# Altium schematic sheet HV_DAC_8ch_FPGA_LVDS.SchDoc: Fastino
size 420 x 297 mm; EDA_Number: ARTIQ; Projet: Fastino; Author: G.Kasprowicz; CompanyName: WUT ISE; DrawnBy: G.Kasprowicz; Organization: WUT ISE; Address1: PW ISE; Address2: Nowowiejska 15/19 00-665 Warsaw; Address3: gkasprow@gmail.com; DocumentNumber: 4; Revision: 2; SheetNumber: 5; SheetTotal: 12; ModifiedBy: -; CheckedDate: -; Title2: FPGA EEM connections; DivGrp: WUT ISE; Designer: G.Kasprowicz; SPICEModelCacheRFUWQEQD: <root> / <DocumentId>RFUWQEQD</DocumentId> / <CacheFrame Number="0"> / <Model Name="pk14" Kind="CKT"> / <Text>*.INC dhvqfn.s / .SUBCKT pk14 / +    1   2   3   4   5   6   7   8   9  10 / +   11  12  13  14 / +   15  16  17  18  19  20  21  22  23  24 / +   25  26  27  28 / * Pin Resistance / r1 1 1001 9.078E-02 / r2 2 1002 8.829E-02 / r3 3 1003 8.731E-02 / r4 4 1004 8.710E-02 / r5 5 1005 8.731E-02 / r6 6 1006 8.829E-02 / r7 7 1007 9.075E-02 / r8 8 1008 9.072E-02 / r9 9 1009 8.809E-02 / r10 10 1010 8.716E-02 / r11 11 1011 8.706E-02 / r12 12 1012 8.720E-02 / r13 13 1013 8.816E-02 / r14 14 1014 9.068E-02 / * Pin Inductance / l1 1001 15 2.981E-09 / l2 1002 16 2.447E-09 / l3 1003 17 2.304E-09 / l4 1004 18 2.291E-09 / l5 1005 19 2.307E-09 / l6 1006 20 2.449E-09 / l7 1007 21 2.971E-09 / l8 1008 22 2.972E-09 / l9 1009 23 2.425E-09 / l10 1010 24 2.286E-09 / l11 1011 25 2.280E-09 / l12 1012 26 2.286E-09 / l13 1013 27 2.425E-09 / l14 1014 28 2.975E-09 / .ENDS pk14</Text> / </Model> / </CacheFrame> / </root>; ModifiedDate: -; ProjectName: Sensor Box
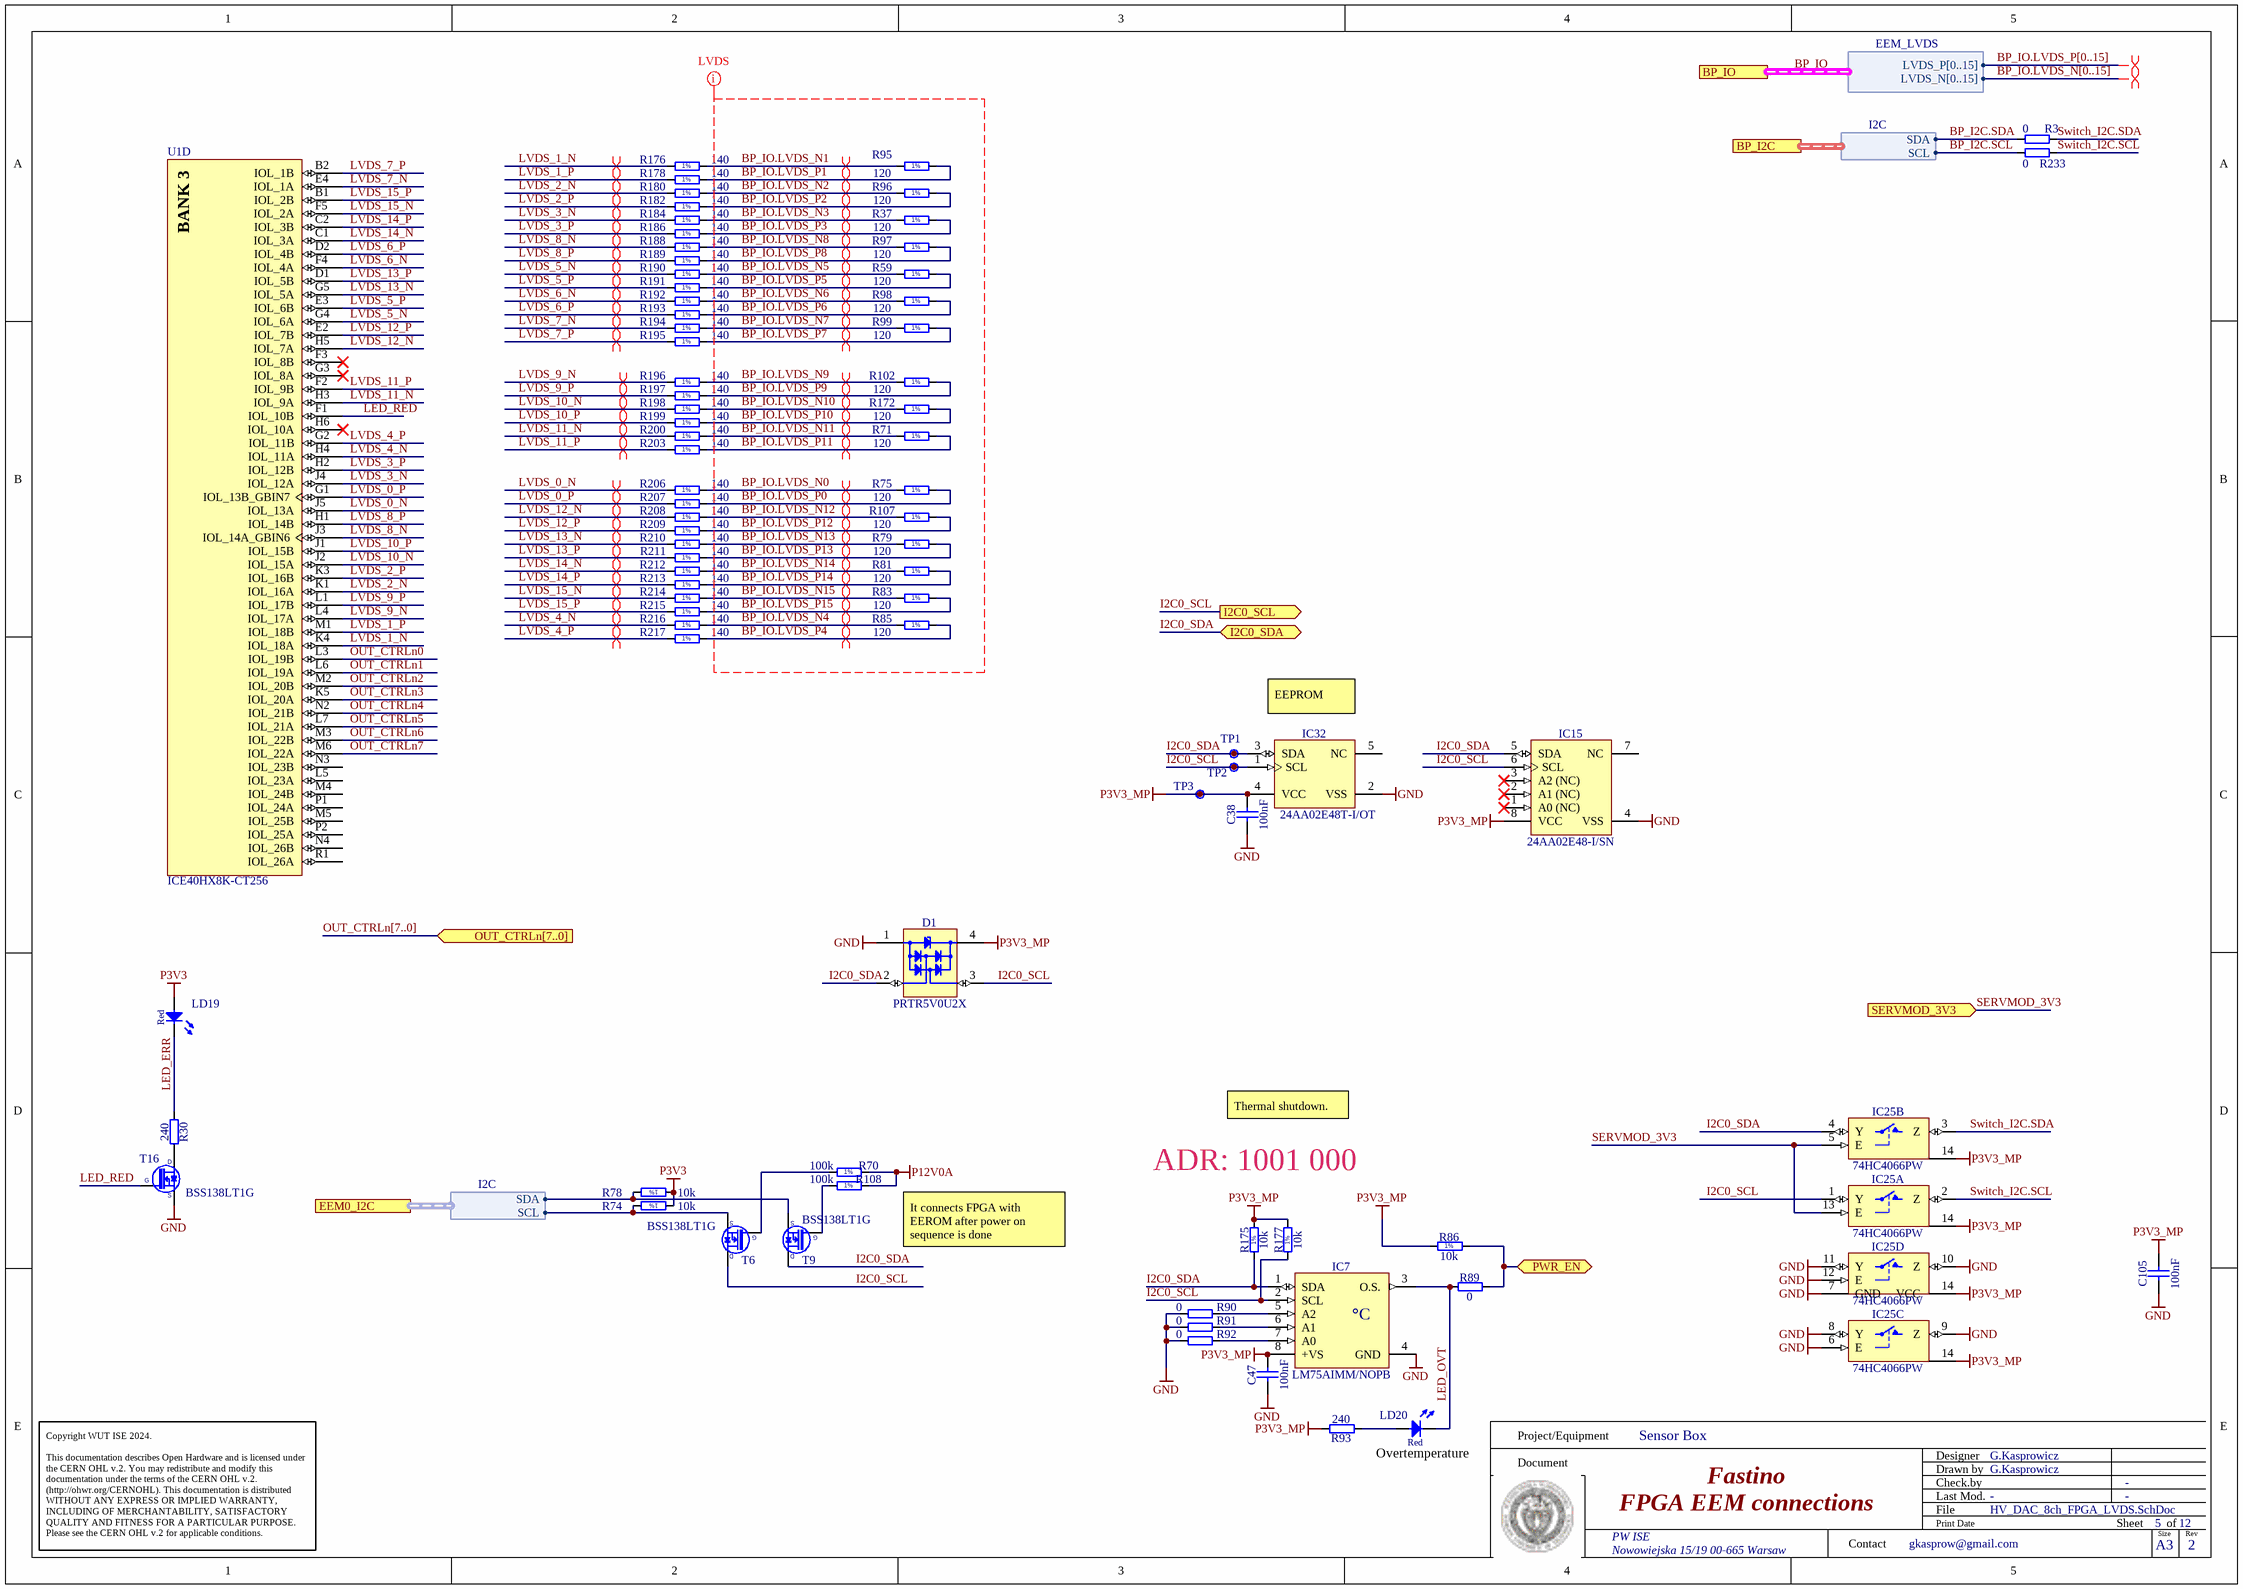
[diagram p0: HV_DAC_8ch_FPGA_LVDS.SchDoc]

## Parts
C38  100nF  [CAPC1005X55N]
C47  100nF  [CAPC1005X55N]
C105  100nF  [CAPC1005X55N]
D1  PRTR5V0U2X  [SOT190P230X110-4N]
IC7  LM75AIMM/NOPB  [SOP65P490X109-8N]
IC15  24AA02E48-I/SN  [SOIC127P600X175-8N]
IC25  74HC4066PW  [SOP65P640X110-14N]  (parts A,B,C,D of 4)
IC32  24AA02E48T-I/OT  [SOT95P280X145-5N]
LD19  Red  [LED_AVAGO_HSMC-C120]
LD20  Red  [LED_AVAGO_HSMC-C120]
R3  0  [RESC1005X40N]
R30  240  [RESC1005X40N]
R37  120  [RESC1005X40N]
R59  120  [RESC1005X40N]
R70  100k  [RESC1005X40N]
R71  120  [RESC1005X40N]
R74  10k  [RESC1005X40N]
R75  120  [RESC1005X40N]
R78  10k  [RESC1005X40N]
R79  120  [RESC1005X40N]
R81  120  [RESC1005X40N]
R83  120  [RESC1005X40N]
R85  120  [RESC1005X40N]
R86  10k  [RESC1005X40N]
R89  0  [RESC1005X40N]
R90  0  [RESC1005X40N]
R91  0  [RESC1005X40N]
R92  0  [RESC1005X40N]
R93  240  [RESC1005X40N]
R95  120  [RESC1005X40N]
R96  120  [RESC1005X40N]
R97  120  [RESC1005X40N]
R98  120  [RESC1005X40N]
R99  120  [RESC1005X40N]
R102  120  [RESC1005X40N]
R107  120  [RESC1005X40N]
R108  100k  [RESC1005X40N]
R172  120  [RESC1005X40N]
R175  10k  [RESC1005X40N]
R176  140  [RESC0603X28N]
R177  10k  [RESC1005X40N]
R178  140  [RESC0603X28N]
R180  140  [RESC0603X28N]
R182  140  [RESC0603X28N]
R184  140  [RESC0603X28N]
R186  140  [RESC0603X28N]
R188  140  [RESC0603X28N]
R189  140  [RESC0603X28N]
R190  140  [RESC0603X28N]
R191  140  [RESC0603X28N]
R192  140  [RESC0603X28N]
R193  140  [RESC0603X28N]
R194  140  [RESC0603X28N]
R195  140  [RESC0603X28N]
R196  140  [RESC0603X28N]
R197  140  [RESC0603X28N]
R198  140  [RESC0603X28N]
R199  140  [RESC0603X28N]
R200  140  [RESC0603X28N]
R203  140  [RESC0603X28N]
R206  140  [RESC0603X28N]
R207  140  [RESC0603X28N]
R208  140  [RESC0603X28N]
R209  140  [RESC0603X28N]
R210  140  [RESC0603X28N]
R211  140  [RESC0603X28N]
R212  140  [RESC0603X28N]
R213  140  [RESC0603X28N]
R214  140  [RESC0603X28N]
R215  140  [RESC0603X28N]
R216  140  [RESC0603X28N]
R217  140  [RESC0603X28N]
R233  0  [RESC1005X40N]
T6  BSS138LT1G  [SOT95P240X110-3N]
T9  BSS138LT1G  [SOT95P240X110-3N]
T16  BSS138LT1G  [SOT95P240X110-3N]
TP1  Test Point  [TPS127]  (value not drawn)
TP2  Test Point  [TPS127]  (value not drawn)
TP3  Test Point  [TPS127]  (value not drawn)
U1  ICE40HX8K-CT256  [LATC-caBGA-256]  (part D of 5)

## Ports
BP_I2C (harness I2C), BP_IO (harness EEM_LVDS), EEM0_I2C (harness I2C), I2C0_SCL (out), I2C0_SDA (bidir), OUT_CTRLn[7..0] (in), PWR_EN (bidir), SERVMOD_3V3 (in)

## Harnesses
I2C: SDA, SCL
EEM_LVDS: LVDS_P[0..15], LVDS_N[0..15]

## Nets
GND: C38.1 C47.1 C105.1 D1.1(GND) IC7.4(GND) IC15.4(VSS) IC25.6(E) IC25.7(GND) IC25.8(Y) IC25.9(Z) IC25.10(Z) IC25.11(Y) IC25.12(E) IC32.2(VSS) R90.1 R91.1 R92.1 T16.2(S)
P3V3: LD19.2(A) R74.1 R78.1
P3V3_MP: C38.2 C47.2 C105.2 D1.4(VCC) IC7.8(+VS) IC15.8(VCC) IC25.14(VCC) IC32.4(VCC) R86.1 R93.2 R175.2 R177.2 TP3.1
P12V0A: R70.2 R108.2
BP_I2C.SCL: R233.1 ; port BP_I2C.SCL
BP_I2C.SDA: R3.1 ; port BP_I2C.SDA
BP_IO.LVDS_N0: R75.1 R206.2
BP_IO.LVDS_N1: R95.1 R176.2
BP_IO.LVDS_N2: R96.1 R180.2
BP_IO.LVDS_N3: R37.1 R184.2
BP_IO.LVDS_N4: R85.1 R216.2
BP_IO.LVDS_N5: R59.1 R190.2
BP_IO.LVDS_N6: R98.1 R192.2
BP_IO.LVDS_N7: R99.1 R194.2
BP_IO.LVDS_N8: R97.1 R188.2
BP_IO.LVDS_N9: R102.1 R196.2
BP_IO.LVDS_N10: R172.1 R198.2
BP_IO.LVDS_N11: R71.1 R200.2
BP_IO.LVDS_N12: R107.1 R208.2
BP_IO.LVDS_N13: R79.1 R210.2
BP_IO.LVDS_N14: R81.1 R212.2
BP_IO.LVDS_N15: R83.1 R214.2
BP_IO.LVDS_P0: R75.2 R207.2
BP_IO.LVDS_P1: R95.2 R178.2
BP_IO.LVDS_P2: R96.2 R182.2
BP_IO.LVDS_P3: R37.2 R186.2
BP_IO.LVDS_P4: R85.2 R217.2
BP_IO.LVDS_P5: R59.2 R191.2
BP_IO.LVDS_P6: R98.2 R193.2
BP_IO.LVDS_P7: R99.2 R195.2
BP_IO.LVDS_P8: R97.2 R189.2
BP_IO.LVDS_P9: R102.2 R197.2
BP_IO.LVDS_P10: R172.2 R199.2
BP_IO.LVDS_P11: R71.2 R203.2
BP_IO.LVDS_P12: R107.2 R209.2
BP_IO.LVDS_P13: R79.2 R211.2
BP_IO.LVDS_P14: R81.2 R213.2
BP_IO.LVDS_P15: R83.2 R215.2
I2C0_SCL: D1.3(I/O2) IC7.2(SCL) IC15.6(SCL) IC25.1(Y) IC32.1(SCL) R177.1 T6.3(D) TP2.1 ; port I2C0_SCL
I2C0_SDA: D1.2(I/O1) IC7.1(SDA) IC15.5(SDA) IC25.4(Y) IC32.3(SDA) R175.1 T9.3(D) TP1.1 ; port I2C0_SDA
LED_ERR: LD19.1(C) R30.1
LED_OVT: IC7.3(O.S.) LD20.1(C) R89.1
LED_RED: T16.1(G) U1.F1(IOL_10B)
LVDS_0_N: R206.1 U1.J5(IOL_13A)
LVDS_0_P: R207.1 U1.G1(IOL_13B_GBIN7)
LVDS_1_N: R176.1 U1.K4(IOL_18A)
LVDS_1_P: R178.1 U1.M1(IOL_18B)
LVDS_2_N: R180.1 U1.K1(IOL_16A)
LVDS_2_P: R182.1 U1.K3(IOL_16B)
LVDS_3_N: R184.1 U1.J4(IOL_12A)
LVDS_3_P: R186.1 U1.H2(IOL_12B)
LVDS_4_N: R216.1 U1.H4(IOL_11A)
LVDS_4_P: R217.1 U1.G2(IOL_11B)
LVDS_5_N: R190.1 U1.G4(IOL_6A)
LVDS_5_P: R191.1 U1.E3(IOL_6B)
LVDS_6_N: R192.1 U1.F4(IOL_4A)
LVDS_6_P: R193.1 U1.D2(IOL_4B)
LVDS_7_N: R194.1 U1.E4(IOL_1A)
LVDS_7_P: R195.1 U1.B2(IOL_1B)
LVDS_8_N: R188.1 U1.J3(IOL_14A_GBIN6)
LVDS_8_P: R189.1 U1.H1(IOL_14B)
LVDS_9_N: R196.1 U1.L4(IOL_17A)
LVDS_9_P: R197.1 U1.L1(IOL_17B)
LVDS_10_N: R198.1 U1.J2(IOL_15A)
LVDS_10_P: R199.1 U1.J1(IOL_15B)
LVDS_11_N: R200.1 U1.H3(IOL_9A)
LVDS_11_P: R203.1 U1.F2(IOL_9B)
LVDS_12_N: R208.1 U1.H5(IOL_7A)
LVDS_12_P: R209.1 U1.E2(IOL_7B)
LVDS_13_N: R210.1 U1.G5(IOL_5A)
LVDS_13_P: R211.1 U1.D1(IOL_5B)
LVDS_14_N: R212.1 U1.C1(IOL_3A)
LVDS_14_P: R213.1 U1.C2(IOL_3B)
LVDS_15_N: R214.1 U1.F5(IOL_2A)
LVDS_15_P: R215.1 U1.B1(IOL_2B)
OUT_CTRLn0: U1.L3(IOL_19B)
OUT_CTRLn1: U1.L6(IOL_19A)
OUT_CTRLn2: U1.M2(IOL_20B)
OUT_CTRLn3: U1.K5(IOL_20A)
OUT_CTRLn4: U1.N2(IOL_21B)
OUT_CTRLn5: U1.L7(IOL_21A)
OUT_CTRLn6: U1.M3(IOL_22B)
OUT_CTRLn7: U1.M6(IOL_22A)
PWR_EN: R86.2 R89.2 ; port PWR_EN
SERVMOD_3V3: IC25.5(E) IC25.13(E) ; port SERVMOD_3V3
Switch_I2C.SCL: IC25.2(Z) R233.2
Switch_I2C.SDA: IC25.3(Z) R3.2
NetIC7_5: IC7.5(A2) R90.2
NetIC7_6: IC7.6(A1) R91.2
NetIC7_7: IC7.7(A0) R92.2
NetLD20_2: LD20.2(A) R93.1
NetR30_2: R30.2 T16.3(D)
NetR70_1: R70.1 T6.1(G)
NetR74_2: R74.2 T6.2(S) ; port EEM0_I2C.SCL
NetR78_2: R78.2 T9.2(S) ; port EEM0_I2C.SDA
NetR108_1: R108.1 T9.1(G)

Not connected (* = marked no-connect by the designer): IC15 1(A0_(NC))* 2(A1_(NC))* 3(A2_(NC))* 7(NC); IC32 5(NC); U1 F3(IOL_8B)* G3(IOL_8A)* H6(IOL_10A)* L5(IOL_23A) M4(IOL_24B) M5(IOL_25B) N3(IOL_23B) N4(IOL_26B) P1(IOL_24A) P2(IOL_25A) R1(IOL_26A)

## Buses and harness runs
bus BP_IO.LVDS_N[0..15]
bus BP_IO.LVDS_P[0..15]
bus OUT_CTRLn[7..0] = port OUT_CTRLn[7..0]
harness BP_IO = port BP_IO

## Layout directives
differential pair; net class D100: BP_IO.LVDS_N0, BP_IO.LVDS_N1, BP_IO.LVDS_N2, BP_IO.LVDS_N3, BP_IO.LVDS_N4, BP_IO.LVDS_N5, BP_IO.LVDS_N6, BP_IO.LVDS_N7, BP_IO.LVDS_N8, BP_IO.LVDS_N9, BP_IO.LVDS_N10, BP_IO.LVDS_N11, BP_IO.LVDS_N12, BP_IO.LVDS_N13, BP_IO.LVDS_N14, BP_IO.LVDS_N15, BP_IO.LVDS_P0, BP_IO.LVDS_P1, BP_IO.LVDS_P2, BP_IO.LVDS_P3, BP_IO.LVDS_P4, BP_IO.LVDS_P5, BP_IO.LVDS_P6, BP_IO.LVDS_P7, BP_IO.LVDS_P8, BP_IO.LVDS_P9, BP_IO.LVDS_P10, BP_IO.LVDS_P11, BP_IO.LVDS_P12, BP_IO.LVDS_P13, BP_IO.LVDS_P14, BP_IO.LVDS_P15, LVDS_0_N, LVDS_0_P, LVDS_1_N, LVDS_1_P, LVDS_2_N, LVDS_2_P, LVDS_3_N, LVDS_3_P, LVDS_4_N, LVDS_4_P, LVDS_5_N, LVDS_5_P, LVDS_6_N, LVDS_6_P, LVDS_7_N, LVDS_7_P, LVDS_8_N, LVDS_8_P, LVDS_9_N, LVDS_9_P, LVDS_10_N, LVDS_10_P, LVDS_11_N, LVDS_11_P, LVDS_12_N, LVDS_12_P, LVDS_13_N, LVDS_13_P, LVDS_14_N, LVDS_14_P, LVDS_15_N, LVDS_15_P
net class LVDS: BP_IO.LVDS_N0, BP_IO.LVDS_N1, BP_IO.LVDS_N2, BP_IO.LVDS_N3, BP_IO.LVDS_N4, BP_IO.LVDS_N5, BP_IO.LVDS_N6, BP_IO.LVDS_N7, BP_IO.LVDS_N8, BP_IO.LVDS_N9, BP_IO.LVDS_N10, BP_IO.LVDS_N11, BP_IO.LVDS_N12, BP_IO.LVDS_N13, BP_IO.LVDS_N14, BP_IO.LVDS_N15, BP_IO.LVDS_P0, BP_IO.LVDS_P1, BP_IO.LVDS_P2, BP_IO.LVDS_P3, BP_IO.LVDS_P4, BP_IO.LVDS_P5, BP_IO.LVDS_P6, BP_IO.LVDS_P7, BP_IO.LVDS_P8, BP_IO.LVDS_P9, BP_IO.LVDS_P10, BP_IO.LVDS_P11, BP_IO.LVDS_P12, BP_IO.LVDS_P13, BP_IO.LVDS_P14, BP_IO.LVDS_P15
differential pair; differential pair class Diff_100Ohm; net class D100: (no net found under the mark)

## Notes on the sheet
- EEPROM
- Thermal shutdown.
- ADR: 1001 000
- It connects FPGA with EEROM after power on sequence is done
- Overtemperature
- Project/Equipment
- Document
- Designer
- Drawn by
- Check.by
- Copyright WUT ISE 2024.
  This documentation describes Open Hardware and is licensed under the CERN OHL v.2. You may redistribute and modify this documentation under the terms of the CERN OHL v.2. (http://ohwr.org/CERNOHL). This documentation is distributed WITHOUT ANY EXPRESS OR IMPLIED WARRANTY, INCLUDING OF MERCHANTABILITY, SATISFACTORY QUALITY AND FITNESS FOR A PARTICULAR PURPOSE. Please see the CERN OHL v.2 for applicable conditions.
- Contact
- File
- Last Mod.
- Print Date
- Sheet
- Size
- A3
- of
- Rev
- (in symbol CMP-0962-00001-1, part D) BANK 3
- (in symbol LM75AIMM/NOPB) °C
- (in symbol R0201_140R_1%_0.05W_200PPM) 1%
- (in symbol R0402_10k_1%_0.0625W_100PPM) 1%
- (in symbol R0402_10K_1%_0.0625W_100PPM) 1%
- (in symbol R0402_100K_1%_0.0625W_100PPM) 1%
- (in symbol R0402_120R_1%_0.0625W_100PPM) 1%

## Library data of the parts
C38 C47 C105 = CC0402_100NF_16V_10%_X5R: Non-polarised capacitor; Part Description: SMD Multilayer Chip Ceramic Capacitor; Manufacturer: GENERIC; Manufacturer1 Part Number: GRM155R61C104KA88D; Voltage: 16V; TC: X5R; Tolerance: ±10%; Part Number: CC0402_100NF_16V_10%_X5R; Component Kind: Standard; Component Type: Standard; Pin Count: 2; Value: 100nF; Status: None; Manufacturer Part Number: CC0402_100NF_16V_10%_X5R; Case: 0402; Mounted: Yes; Socket: No; SMD: Yes; Sense: No; Manufacturer1 Example: MURATA; Manufacturer1 ComponentHeight: 0.55mm; HelpURL: \\cern.ch\dfs\Applications\Altium\Datasheets\CC0402_X5R_MURATA_GRM.pdf; Author: CERN DEM JLC; CreateDate: 10.12.2013; LatestRevisionDate: 10.12.2013
D1 = PRTR5V0U2X: Ultra Low Capacitance Double Rail-to-Rail ESD Protection Diode; Part Description: Ultra Low Capacitance (1pF) Double Rail-to-Rail ESD Protection Diode (8kV); Manufacturer: NXP SEMICONDUCTORS; Voltage: 5.5V; PressFit: No; Bonding: No; Part Number: PRTR5V0U2X; Component Kind: Standard; Component Type: Standard; Device: PRTR5V0U2X; PackageDescription: SOT143B, SOT, 1.90mm Pitch; 4 Pin, 1.30mm W X 2.90mm L X 1.10mm H body, IPC Medium Density; Manufacturer Part Number: PRTR5V0U2X; Pin Count: 4; Case: SOT143B; Mounted: Yes; Socket: No; SMD: Yes; Sense: No; ComponentHeight: 1.1mm; HelpURL: \\cern.ch\dfs\Applications\Altium\Datasheets\PRTR5V0U2X.pdf; Author: CERN DEM JLC; CreateDate: 22.03.2011; LatestRevisionDate: 22.03.2011
IC7 = LM75AIMM/NOPB: Digital Temperature Sensor and Thermal Watchdog with Two-Wire Interface; Part Description: -25° to +100°C ±2°C Digital Temperature Sensor and Thermal Watchdog with Two-Wire Interface; Manufacturer: TEXAS INSTRUMENTS; PressFit: No; Bonding: No; Part Number: LM75AIMM/NOPB; Component Kind: Standard; Component Type: Standard; Device: LM75AIMM/NOPB; PackageDescription: SOP, 0.65mm pitch; 8 pin,3.00mm W X 3.00mm L X 1.09mm H bodyI, PC Medium Density; Manufacturer Part Number: LM75AIMM/NOPB; Pin Count: 8; Case: SSOP8; Mounted: Yes; Socket: No; SMD: Yes; Sense: No; ComponentHeight: 1.09mm; HelpURL: \\cern.ch\dfs\Applications\Altium\Datasheets\LM75AIMM-NOPB.pdf; Author: CERN DEM JLC; CreateDate: 15.10.2012; LatestRevisionDate: 15.10.2012
IC15 = MEM_24AA02E48-I/SN: 1.7V-5.5V, 2K I2C™ Serial EEPROMs with EUI-48™ Node Identity; Manufacturer: MICROCHIP TECHNOLOGY; PressFit: No; Bonding: No; Part Number: 24AA02E48-I/SN; Component Kind: Standard; Component Type: Standard; Device: 24AA02E48-I/SN; PackageDescription: SOIC, 1.27mm Pitch; 8 Pin - Body 4x5mm, IPC Medium Density; Part Description: 1.7V-5.5V, 2K I2C™ Serial EEPROMs with EUI-48™ Node Identity; Manufacturer Part Number: 24AA02E48-I/SN; Pin Count: 8; Case: SOIC8; Mounted: Yes; Socket: No; SMD: Yes; Sense: No; ComponentHeight: 1.75mm; HelpURL: \\cern.ch\dfs\Applications\Altium\Datasheets\24AA025E48-I-SN.pdf; Author: CERN DEM MR; CreateDate: 19.07.2016; LatestRevisionDate: 19.07.2016
IC25 = 74HC4066PW: Part Description: Quad Single-Pole Single-Throw Analog Switch; Manufacturer: NXP SEMICONDUCTORS; PressFit: No; Bonding: No; Table: Standard Logic; Part Number: 74HC4066PW; Component Kind: Standard; Component Type: Standard; Device: 74HC4066PW; PackageDescription: SOP, 14-Leads, Body 4.4x5mm (max), Pitch 0.65mm, IPC Medium Density; Manufacturer Part Number: 74HC4066PW; Pin Count: 14; Case: TSSOP14; Mounted: Yes; Socket: No; SMD: Yes; ComponentHeight: 1.1mm; Author: CERN DEM JLC; HelpURL: \\cern.ch\dfs\Applications\Altium\Datasheets\74HC4066PW.pdf; CreateDate: 2014-11-19; LatestRevisionDate: 2014-11-19
IC32 = 24AA02E48T-I/OT: 1.7V-5.5V, 2K I2C Serial EEPROM With EUI-48 Node Identity; Manufacturer: MICROCHIP TECHNOLOGY; PressFit: No; Bonding: No; Part Number: 24AA02E48T-I/OT; Component Kind: Standard; Component Type: Standard; Device: 24AA02E48T-I/OT; PackageDescription: SOT, 0.95mm pitch; 5 pin, 1.60mm W X 2.90mm L X 1.45mm H body, IPC Medium Density; Part Description: 1.7V-5.5V, 2K I2C Serial EEPROM With EUI-48 Node Identity; Manufacturer Part Number: 24AA02E48T-I/OT; Pin Count: 5; Case: SOT23-5; Mounted: Yes; Socket: No; SMD: Yes; Sense: No; ComponentHeight: 1.45mm; HelpURL: \\cern.ch\dfs\Applications\Altium\Datasheets\24AA02E48T-I-OT.pdf; Author: CERN DEM MR; CreateDate: 31.03.2016; LatestRevisionDate: 31.03.2016
LD19 LD20 = LED_AVAGO_HSMC-C120: LED Red 1C 2A; Part Description: High Performance Right Angle Chip Red LED; Manufacturer: AVAGO TECHNOLOGIES; PressFit: No; Bonding: No; Part Number: LED_AVAGO_HSMC-C120; Component Kind: Standard; Component Type: Standard; Color: Red; PackageDescription: Red Chip LED, 2-Leads, Body 1.7x1.1mm, Side Emitting Package; Manufacturer Part Number: HSMC-C120; Pin Count: 2; Mounted: Yes; Socket: No; SMD: Yes; Sense: No; ComponentHeight: 0.7mm; HelpURL: \\cern.ch\dfs\Applications\Altium\Datasheets\LED_AVAGO_HSMC-C120.pdf; ComponentLink1URL: \\cern.ch\dfs\Applications\Altium\Datasheets\LED_AVAGO_HSMC-C120_DESIGN-GUIDE.pdf; ComponentLink1Description: Design Guide; Author: CERN DEM JMW; CreateDate: 22.07.2009; LatestRevisionDate: 20.06.2012
R3 R233 = R0402_0R_JUMPER: Resistor; Part Description: 1A (0.05R Max DC Resistance) Zero Ohm Jumper; Manufacturer: GENERIC; Manufacturer1 Part Number: 232270591001L; PressFit: No; Part Number: R0402_0R_JUMPER; Component Kind: Standard; Component Type: Standard; Pin Count: 2; Value: 0; Status: Not Recommended; Manufacturer Part Number: R0402_0R_JUMPER; Case: 0402; Mounted: Yes; Sense: No; Socket: No; SMD: Yes; Manufacturer1 Example: YAGEO PHYCOMP; Manufacturer1 ComponentHeight: 0.4mm; HelpURL: \\cern.ch\dfs\Applications\Altium\Datasheets\R0402_Phycomp_RC0402.pdf; Author: CERN DEM JLC; CreateDate: 03.12.2007; LatestRevisionDate: 17.10.2012
R30 R93 = R0402_240R_1%_0.0625W_100PPM: Resistor - 1%; Part Description: General Purpose Thick Film Chip Resistor; Manufacturer: GENERIC; Manufacturer1 Part Number: 232270672401L; TC: ±100ppm/°C; PressFit: No; Part Number: R0402_240R_1%_0.0625W_100PPM; Component Kind: Standard; Component Type: Standard; Pin Count: 2; Value: 240; Status: Not Recommended; Power: 0.0625W; Tolerance: ±1%; Manufacturer Part Number: R0402_240R_1%_0.0625W_100PPM; Case: 0402; Mounted: Yes; Sense: No; Socket: No; SMD: Yes; Manufacturer1 Example: YAGEO PHYCOMP; Manufacturer1 ComponentHeight: 0.4mm; HelpURL: \\cern.ch\dfs\Applications\Altium\Datasheets\R0402_Phycomp_RC0402.pdf; Author: CERN DEM JLC; CreateDate: 03.12.2007; LatestRevisionDate: 17.10.2012
R37 R59 R71 R75 R79 R81 R83 R85 R95-R99 R102 R107 R172 = R0402_120R_1%_0.0625W_100PPM: Resistor - 1%; Part Description: General Purpose Thick Film Chip Resistor; Manufacturer: GENERIC; Manufacturer1 Part Number: 232270671201L; TC: ±100ppm/°C; PressFit: No; Part Number: R0402_120R_1%_0.0625W_100PPM; Component Kind: Standard; Component Type: Standard; Pin Count: 2; Value: 120; Status: Not Recommended; Power: 0.0625W; Tolerance: ±1%; Manufacturer Part Number: R0402_120R_1%_0.0625W_100PPM; Case: 0402; Mounted: Yes; Sense: No; Socket: No; SMD: Yes; Manufacturer1 Example: YAGEO PHYCOMP; Manufacturer1 ComponentHeight: 0.4mm; HelpURL: \\cern.ch\dfs\Applications\Altium\Datasheets\R0402_Phycomp_RC0402.pdf; Author: CERN DEM JLC; CreateDate: 03.12.2007; LatestRevisionDate: 17.10.2012
R70 R108 = R0402_100K_1%_0.0625W_100PPM: Resistor - 1%; Part Description: General Purpose Thick Film Chip Resistor; Manufacturer: GENERIC; Manufacturer1 Part Number: 232270671004L; TC: ±100ppm/°C; PressFit: No; Part Number: R0402_100K_1%_0.0625W_100PPM; Component Kind: Standard; Component Type: Standard; Pin Count: 2; Value: 100k; Status: Not Recommended; Power: 0.0625W; Tolerance: ±1%; Manufacturer Part Number: R0402_100K_1%_0.0625W_100PPM; Case: 0402; Mounted: Yes; Sense: No; Socket: No; SMD: Yes; Manufacturer1 Example: YAGEO PHYCOMP; Manufacturer1 ComponentHeight: 0.4mm; HelpURL: \\cern.ch\dfs\Applications\Altium\Datasheets\R0402_Phycomp_RC0402.pdf; Author: CERN DEM JLC; CreateDate: 03/12/2007; LatestRevisionDate: 17/10/2012
R74 R78 = R0402_10k_1%_0.0625W_100PPM: Resistor - 1%; Part Description: General Purpose Thick Film Chip Resistor; Manufacturer: GENERIC; Manufacturer1 Part Number: 232270671003L; TC: ±100ppm/°C; PressFit: No; Part Number: R0402_10K_1%_0.0625W_100PPM; Component Kind: Standard; Component Type: Standard; Pin Count: 2; Value: 10k; Status: Not Recommended; Power: 0.0625W; Tolerance: ±1%; Manufacturer Part Number: R0402_10K_1%_0.0625W_100PPM; Case: 0402; Mounted: Yes; Sense: No; Socket: No; SMD: Yes; Manufacturer1 Example: YAGEO PHYCOMP; Manufacturer1 ComponentHeight: 0.4mm; HelpURL: \\cern.ch\dfs\Applications\Altium\Datasheets\R0402_Phycomp_RC0402.pdf; Author: CERN DEM JLC; CreateDate: 03.12.2007; LatestRevisionDate: 17.10.2012
R86 R175 R177 = R0402_10K_1%_0.0625W_100PPM: Resistor - 1%; Part Description: General Purpose Thick Film Chip Resistor; Manufacturer: GENERIC; Manufacturer1 Part Number: 232270671003L; TC: ±100ppm/°C; PressFit: No; Part Number: R0402_10K_1%_0.0625W_100PPM; Component Kind: Standard; Component Type: Standard; Pin Count: 2; Value: 10k; Status: Not Recommended; Power: 0.0625W; Tolerance: ±1%; Manufacturer Part Number: R0402_10K_1%_0.0625W_100PPM; Case: 0402; Mounted: Yes; Sense: No; Socket: No; SMD: Yes; Manufacturer1 Example: YAGEO PHYCOMP; Manufacturer1 ComponentHeight: 0.4mm; HelpURL: \\cern.ch\dfs\Applications\Altium\Datasheets\R0402_Phycomp_RC0402.pdf; Author: CERN DEM JLC; CreateDate: 03.12.2007; LatestRevisionDate: 17.10.2012
R89-R92 = R0402_0R_JUMPER: Resistor; Part Description: 1A (0.05R Max DC Resistance) Zero Ohm Jumper; Manufacturer: GENERIC; Manufacturer1 Part Number: 232270591001L; Part Number: R0402_0R_JUMPER; Component Kind: Standard; Component Type: Standard; Pin Count: 2; Value: 0; Status: Not recommended; Manufacturer Part Number: R0402_0R_JUMPER; Case: 0402; Mounted: Yes; Sense: No; Socket: No; SMD: Yes; Manufacturer1 Example: YAGEO PHYCOMP; Manufacturer1 ComponentHeight: 0.4mm; HelpURL: \\cern.ch\dfs\Applications\Altium\Datasheets\R0402_Phycomp_RC0402.pdf; Author: CERN DEM JLC; CreateDate: 03.12.2007; LatestRevisionDate: 17.10.2012
R176 R178 R180 R182 R184 R186 R188-R200 R203 R206-R217 = R0201_140R_1%_0.05W_200PPM: Resistor - 1%; Part Description: Thick Film Chip Resistor; Manufacturer: GENERIC; Manufacturer1 Part Number: CRCW0201140RFNED; Power: 0.05W; TC: ±200ppm/°C; PressFit: No; Part Number: R0201_140R_1%_0.05W_200PPM; Component Kind: Standard; Component Type: Standard; Pin Count: 2; Value: 140; Status: Not Recommended; Tolerance: ±1%; Manufacturer Part Number: R0201_140R_1%_0.05W_200PPM; Case: 0201; Mounted: Yes; Sense: No; Socket: No; SMD: Yes; Manufacturer1 Example: VISHAY; Manufacturer1 ComponentHeight: 0.27mm; HelpURL: \\cern.ch\dfs\Applications\Altium\Datasheets\R0201_VISHAY_CRCW e3.pdf; Author: CERN DEM MR; CreateDate: 26/01/2016; LatestRevisionDate: 26/01/2016
T6 T9 T16 = BSS138LT1G: N-CHANNEL MOSFET WITH DIODE; Part Description: 50V 200mA N-Channel Enhancement Mode Field-Effect Transistor; Manufacturer: ON SEMICONDUCTOR; PressFit: No; Bonding: No; Part Number: BSS138LT1G; Component Kind: Standard; Component Type: Standard; Device: BSS138LT1G; PackageDescription: SOT23 3-Leads, Pitch 0.95mm - Body 1.4x3mm, IPC Medium Density; Manufacturer Part Number: BSS138LT1G; Pin Count: 3; Case: SOT23-3; Mounted: Yes; Socket: No; SMD: Yes; Sense: No; ComponentHeight: 1.11mm; HelpURL: \\cern.ch\dfs\Applications\Altium\Datasheets\BSS138LT1G.pdf; Author: CERN DEM JLC; CreateDate: 23.03.2009; LatestRevisionDate: 23.03.2009
TP1-TP3 = SMD_PAD_1.27X1.27MM: Part Description: 1.27mm x 1.27mm PCB Copper Area (SMD Test Point); Mounted: No; Part Number: SMD_PAD_1.27X1.27MM; Component Kind: Standard (No BOM); Component Type: Standard (No BOM); Pin Count: 1; Family: Test Point; Socket: No; SMD: Yes; Sense: No; Status: None; ComponentHeight: 0mm; HelpURL: Undefined; Author: CERN DEM JLC; CreateDate: 12.01.2008; LatestRevisionDate: 12.01.2008; PackageDescription: 1.27mm x 1.27mm PCB Copper Area (SMD Test Point)
U1 = CMP-0962-00001-1: iCE40 HX8K Series FPGA Family, 7680 Logic Cells, 1.2 V Core, 128 K Embedded RAM Bits, 256-ball caBGA, Pb-Free, Tray; Manufacturer: Lattice Semiconductor; Supply Voltage: 1.2V; Phase-Locked Loops: 2; Logic Cells: 7680; Embedded RAM Bits: 128K; PackageReference: caBGA-256; PackageDescription: 256-Ball Chip Array Ball Grid Array, Body 14 x 14 mm, Pitch 0.8 mm; RoHS: TRUE; Packing: Tray; Mounting Technology: Surface Mount; ComponentLink3URL: http://www.latticesemi.com/lit/docs/package/pkg.pdf; ComponentLink1Description: Manufacturer URL; ComponentLink3Description: Package Specification; Code_JEDEC: MO-275; PackageVersion: Rev. 03.9, 02/2013; ComponentLink1URL: http://www.latticesemi.com/en; ComponentLink2URL: http://www.latticesemi.com/~/media/Documents/DataSheets/iCE/iCE40LPHXFamilyDataSheet.pdf; Manufacturer Part Number: ICE40HX8K-CT256; ComponentLink2Description: Datasheet; DatasheetVersion: Rev. 02.9